# Altium schematic sheet SFR_PORTS.SCHDOC
size A3; Organization: Altium Limited; Address1: L3, 12a Rodborough Rd; Address2: Frenchs Forest; Address3: NSW; Address4: Australia 2086; DocumentNumber: 2; SheetNumber: 12; SheetTotal: 13
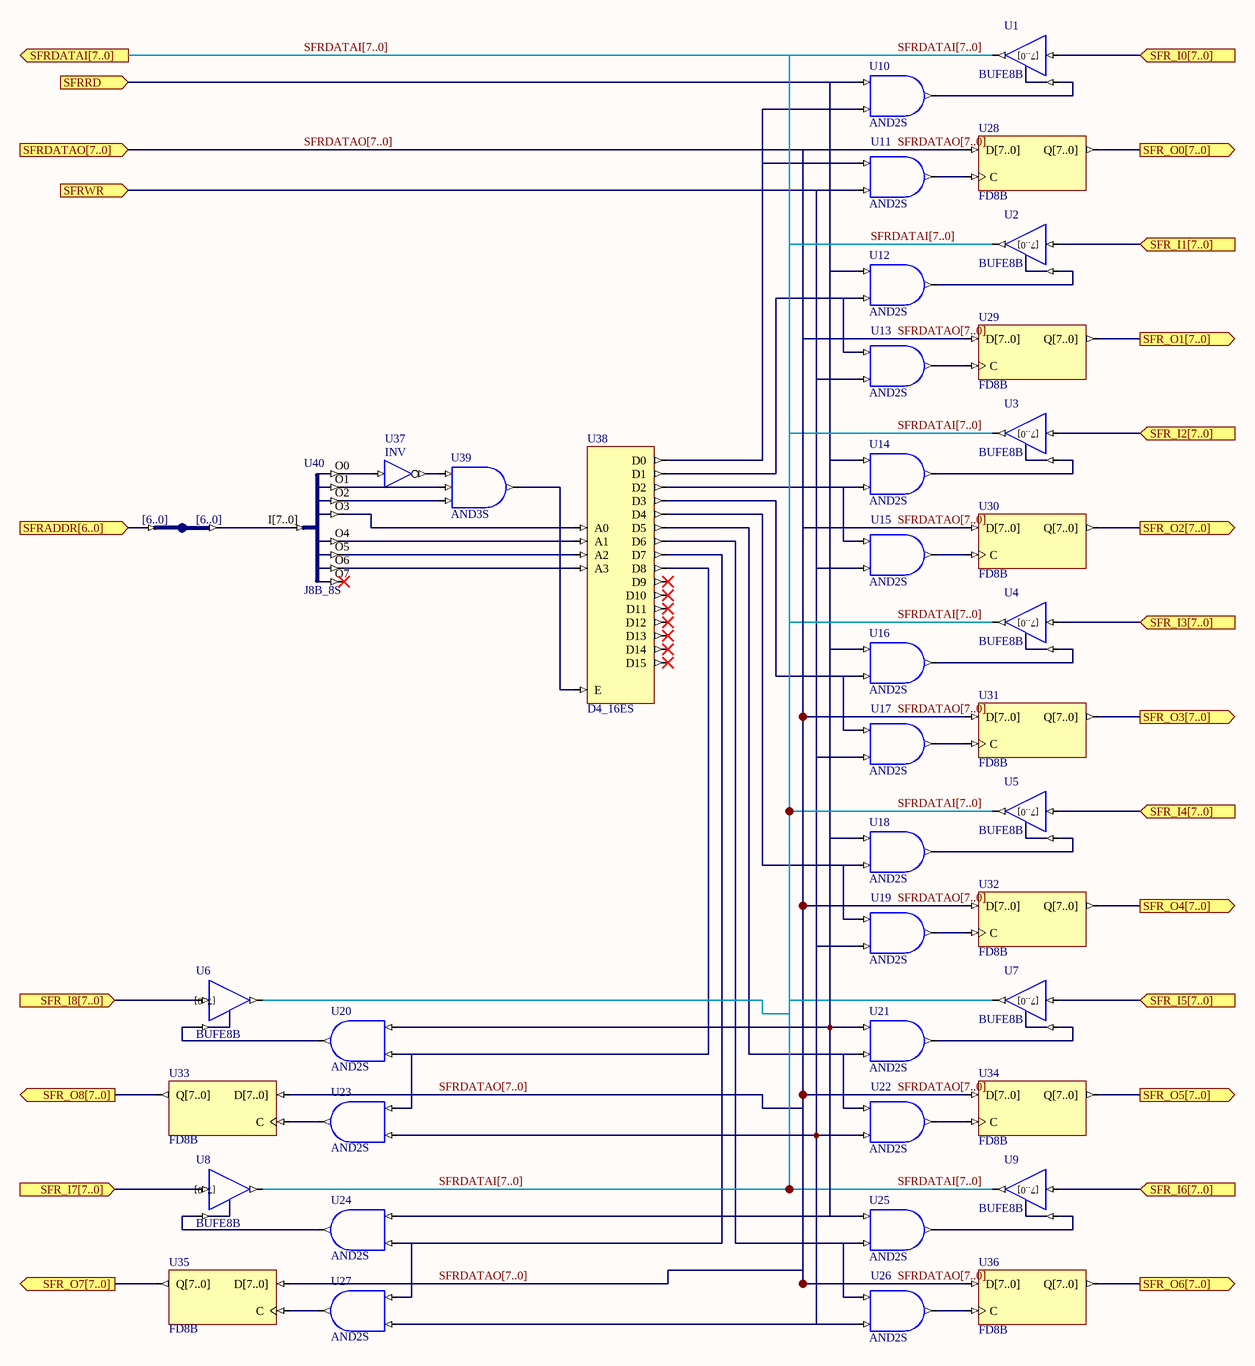
[diagram p0: SFR_PORTS.SCHDOC]

## Parts
JB_S1  IndexA: [6..0]  (hidden comment: JB)
U1  BUFE8B
U2  BUFE8B
U3  BUFE8B
U4  BUFE8B
U5  BUFE8B
U6  BUFE8B
U7  BUFE8B
U8  BUFE8B
U9  BUFE8B
U10  AND2S
U11  AND2S
U12  AND2S
U13  AND2S
U14  AND2S
U15  AND2S
U16  AND2S
U17  AND2S
U18  AND2S
U19  AND2S
U20  AND2S
U21  AND2S
U22  AND2S
U23  AND2S
U24  AND2S
U25  AND2S
U26  AND2S
U27  AND2S
U28  FD8B
U29  FD8B
U30  FD8B
U31  FD8B
U32  FD8B
U33  FD8B
U34  FD8B
U35  FD8B
U36  FD8B
U37  INV
U38  D4_16ES
U39  AND3S
U40  J8B_8S

## Ports
SFR_I0[7..0] (in), SFR_I1[7..0] (in), SFR_I2[7..0] (in), SFR_I3[7..0] (in), SFR_I4[7..0] (in), SFR_I5[7..0] (in), SFR_I6[7..0] (in), SFR_I7[7..0] (in), SFR_I8[7..0] (in), SFR_O0[7..0] (out), SFR_O1[7..0] (out), SFR_O2[7..0] (out), SFR_O3[7..0] (out), SFR_O4[7..0] (out), SFR_O5[7..0] (out), SFR_O6[7..0] (out), SFR_O7[7..0] (out), SFR_O8[7..0] (out), SFRADDR[6..0] (in), SFRDATAI[7..0] (out), SFRDATAO[7..0] (in), SFRRD (in), SFRWR (in)

## Nets
SFR_I0[7..0]: U1.I[7..0] ; port SFR_I0[7..0]
SFR_I1[7..0]: U2.I[7..0] ; port SFR_I1[7..0]
SFR_I2[7..0]: U3.I[7..0] ; port SFR_I2[7..0]
SFR_I3[7..0]: U4.I[7..0] ; port SFR_I3[7..0]
SFR_I4[7..0]: U5.I[7..0] ; port SFR_I4[7..0]
SFR_I5[7..0]: U7.I[7..0] ; port SFR_I5[7..0]
SFR_I6[7..0]: U9.I[7..0] ; port SFR_I6[7..0]
SFR_I7[7..0]: U8.I[7..0] ; port SFR_I7[7..0]
SFR_I8[7..0]: U6.I[7..0] ; port SFR_I8[7..0]
SFR_O0[7..0]: U28.Q[7..0] ; port SFR_O0[7..0]
SFR_O1[7..0]: U29.Q[7..0] ; port SFR_O1[7..0]
SFR_O2[7..0]: U30.Q[7..0] ; port SFR_O2[7..0]
SFR_O3[7..0]: U31.Q[7..0] ; port SFR_O3[7..0]
SFR_O4[7..0]: U32.Q[7..0] ; port SFR_O4[7..0]
SFR_O5[7..0]: U34.Q[7..0] ; port SFR_O5[7..0]
SFR_O6[7..0]: U36.Q[7..0] ; port SFR_O6[7..0]
SFR_O7[7..0]: U35.Q[7..0] ; port SFR_O7[7..0]
SFR_O8[7..0]: U33.Q[7..0] ; port SFR_O8[7..0]
SFRADDR[6..0]: JB_S1.A[0..0](IA[0..0]) ; port SFRADDR[6..0]
SFRDATAI[7..0]: U1.O[7..0] U2.O[7..0] U3.O[7..0] U4.O[7..0] U5.O[7..0] U6.O[7..0] U7.O[7..0] U8.O[7..0] U9.O[7..0] ; port SFRDATAI[7..0]
SFRDATAO[7..0]: U28.D[7..0] U29.D[7..0] U30.D[7..0] U31.D[7..0] U32.D[7..0] U33.D[7..0] U34.D[7..0] U35.D[7..0] U36.D[7..0] ; port SFRDATAO[7..0]
SFRRD: U10.I0 U12.I0 U14.I0 U16.I0 U18.I0 U20.I0 U21.I0 U24.I0 U25.I0 ; port SFRRD
SFRWR: U11.I1 U13.I1 U15.I1 U17.I1 U19.I1 U22.I1 U23.I1 U26.I1 U27.I1 ; port SFRWR
NetJB_S1_B[0..0]: JB_S1.B[0..0] U40.I[7..0]
NetU1_E: U1.E U10.O
NetU2_E: U2.E U12.O
NetU3_E: U3.E U14.O
NetU4_E: U4.E U16.O
NetU5_E: U5.E U18.O
NetU6_E: U6.E U20.O
NetU7_E: U7.E U21.O
NetU8_E: U8.E U24.O
NetU9_E: U9.E U25.O
NetU10_I1: U10.I1 U11.I0 U38.D0
NetU11_O: U11.O U28.C
NetU12_I1: U12.I1 U13.I0 U38.D1
NetU13_O: U13.O U29.C
NetU14_I1: U14.I1 U15.I0 U38.D2
NetU15_O: U15.O U30.C
NetU16_I1: U16.I1 U17.I0 U38.D3
NetU17_O: U17.O U31.C
NetU18_I1: U18.I1 U19.I0 U38.D4
NetU19_O: U19.O U32.C
NetU20_I1: U20.I1 U23.I0 U38.D8
NetU21_I1: U21.I1 U22.I0 U38.D5
NetU22_O: U22.O U34.C
NetU23_O: U23.O U33.C
NetU24_I1: U24.I1 U27.I0 U38.D7
NetU25_I1: U25.I1 U26.I0 U38.D6
NetU26_O: U26.O U36.C
NetU27_O: U27.O U35.C
NetU37_I: U37.I U40.O0
NetU37_O: U37.O U39.I0
NetU38_A0: U38.A0 U40.O3
NetU38_A1: U38.A1 U40.O4
NetU38_A2: U38.A2 U40.O5
NetU38_A3: U38.A3 U40.O6
NetU38_E: U38.E U39.O
NetU39_I1: U39.I1 U40.O1
NetU39_I2: U39.I2 U40.O2

Not connected (* = marked no-connect by the designer): U38 D9* D10* D11* D12* D13* D14* D15*; U40 O7*

## Buses and harness runs
bus SFRDATAI[7..0] = port SFRDATAI[7..0]
bus SFRDATAO[7..0] = port SFRDATAO[7..0]

## Notes on the sheet
- Title
- Size:
- Date:
- A3
- Number:
- Time:
- Revision:
- Sheet
- of
- File:
- (in symbol BUFE8B) [7..0]

## Library data of the parts
JB_S1 = JB: System Joiner; ArchiveName: GENERIC; Published: 7-Nov-2003; Publisher: Altium Limited; Core Revision: 1.00.00; IndexB: [6..0]
U1-U9 = BUFE8B: 8-Bit 3-state Buffer with Active High Enable, Bus Version; Xilinx Equivalent: BUFE8; ArchiveName: GENERIC; Published: 7-Nov-2003; Publisher: Altium Limited; Core Revision: 1.00.00
U10-U27 = AND2S: 2-Input AND Gate, Single Pin Version; Xilinx Equivalent: AND2; ArchiveName: GENERIC; Published: 7-Nov-2003; Publisher: Altium Limited; Core Revision: 1.00.00
U28-U36 = FD8B: 8-Bit D-Type Flip-Flop, Bus Version; Xilinx Equivalent: FD8; ArchiveName: GENERIC; Published: 7-Nov-2003; Publisher: Altium Limited; Core Revision: 1.00.00
U37 = INV: Inverter; ArchiveName: GENERIC; Published: 7-Nov-2003; Publisher: Altium Limited; Xilinx Equivalent: INV; Core Revision: 1.00.00
U38 = D4_16ES: Binary 4- to 16-Bit Decoder with Enable, Single Pin Version; Xilinx Equivalent: D4_16E; ArchiveName: GENERIC; Published: 7-Nov-2003; Publisher: Altium Limited; Core Revision: 1.00.00
U39 = AND3S: 3-Input AND Gate, Single Pin Version; Xilinx Equivalent: AND3; ArchiveName: GENERIC; Published: 7-Nov-2003; Publisher: Altium Limited; Core Revision: 1.00.00
U40 = J8B_8S: 8-Bit input bus to 8 single pin outputs; ArchiveName: GENERIC; Published: 7-Nov-2003; Publisher: Altium Limited; Core Revision: 1.00.00